# Altium schematic sheet [4] - ESP32 SUBSYSTEM SCHEMATIC.SchDoc
size A2; DocumentNumber: 4; SheetNumber: 4; SheetTotal: 6

## Parts
?  (no value)  (graphical)

## Notes on the sheet
- Title:
- Page Contents:
- Variant:
- Checked by
- Size:
- Date:
- DWG NO
- Designed by
- Sheet
- of
- Revision:

## Library data of the parts
? = SDTitleBlock